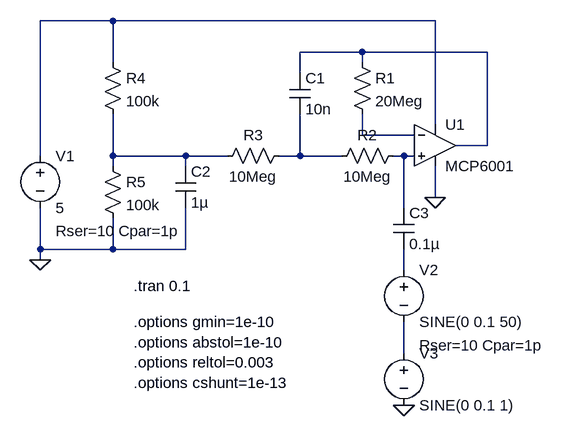
[diagram p0: schematic piezo.asc]
piezo.asc, the LTspice schematic file:
Version 4
SHEET 1 880 680
WIRE -96 -96 -208 -96
WIRE 400 -96 -96 -96
WIRE 288 -48 192 -48
WIRE 480 -48 288 -48
WIRE -96 -32 -96 -96
WIRE 288 -32 288 -48
WIRE 192 -16 192 -48
WIRE 400 64 400 -96
WIRE 288 80 288 48
WIRE 368 80 288 80
WIRE 480 96 480 -48
WIRE 480 96 432 96
WIRE -208 112 -208 -96
WIRE -96 112 -96 48
WIRE 16 112 -96 112
WIRE 80 112 16 112
WIRE 192 112 192 48
WIRE 192 112 160 112
WIRE 256 112 192 112
WIRE 352 112 336 112
WIRE 368 112 352 112
WIRE -96 128 -96 112
WIRE 16 128 16 112
WIRE 400 176 400 128
WIRE 352 192 352 112
WIRE -208 256 -208 192
WIRE -96 256 -96 208
WIRE -96 256 -208 256
WIRE 16 256 16 192
WIRE 16 256 -96 256
WIRE -208 272 -208 256
WIRE 352 288 352 256
WIRE 352 416 352 368
FLAG -208 272 0
FLAG 400 176 0
FLAG 352 496 0
SYMBOL Overige\ componenten\\voltage -208 96 R0
WINDOW 123 0 0 Left 2
WINDOW 39 24 132 Left 2
SYMATTR SpiceLine Rser=10 Cpar=1p
SYMATTR InstName V1
SYMATTR Value 5
SYMBOL Overige\ componenten\\voltage 352 272 R0
WINDOW 123 0 0 Left 2
WINDOW 39 24 132 Left 2
SYMATTR SpiceLine Rser=10 Cpar=1p
SYMATTR InstName V2
SYMATTR Value SINE(0 0.1 50)
SYMBOL res 272 -48 R0
SYMATTR InstName R1
SYMATTR Value 20Meg
SYMBOL res 352 96 R90
WINDOW 0 0 56 VBottom 2
WINDOW 3 32 56 VTop 2
SYMATTR InstName R2
SYMATTR Value 10Meg
SYMBOL cap 176 -16 R0
SYMATTR InstName C1
SYMATTR Value 10n
SYMBOL res -112 -48 R0
SYMATTR InstName R4
SYMATTR Value 100k
SYMBOL res -112 112 R0
SYMATTR InstName R5
SYMATTR Value 100k
SYMBOL cap 0 128 R0
SYMATTR InstName C2
SYMATTR Value 1µ
SYMBOL res 176 96 R90
WINDOW 0 0 56 VBottom 2
WINDOW 3 32 56 VTop 2
SYMATTR InstName R3
SYMATTR Value 10Meg
SYMBOL cap 336 192 R0
SYMATTR InstName C3
SYMATTR Value 0.1µ
SYMBOL AutoGenerated\\MCP6001 400 32 R0
SYMATTR InstName U1
SYMBOL Overige\ componenten\\voltage 352 400 R0
WINDOW 123 0 0 Left 2
WINDOW 39 0 0 Left 2
SYMATTR InstName V3
SYMATTR Value SINE(0 0.1 1)
TEXT -64 312 Left 2 !.tran 0.1
TEXT -64 368 Left 2 !.options gmin=1e-10\n.options abstol=1e-10\n.options reltol=0.003\n.options cshunt=1e-13

The netlist it stands for:
* piezo.asc
V1 N001 0 5 Rser=10 Cpar=1p
V2 N007 N008 SINE(0 0.1 50) Rser=10 Cpar=1p
R1 N002 N003 20Meg
R2 N006 N005 10Meg
C1 N002 N005 10n
R4 N001 N004 100k
R5 N004 0 100k
C2 N004 0 1µ
R3 N005 N004 10Meg
C3 N006 N007 0.1µ
* U1: MCP6001 (symbol AutoGenerated\MCP6001 not available, pins judged from their places): In+=N006 In-=N003 V+=N001 V-=0 OUT=N002
V3 N008 0 SINE(0 0.1 1)
.tran 0.1
.options gmin=1e-10
.options abstol=1e-10
.options reltol=0.003
.options cshunt=1e-13
.backanno
.end